# EAGLE schematic PVScontroller_v1_2_with_logo-multiple (EAGLE 7.2.0)
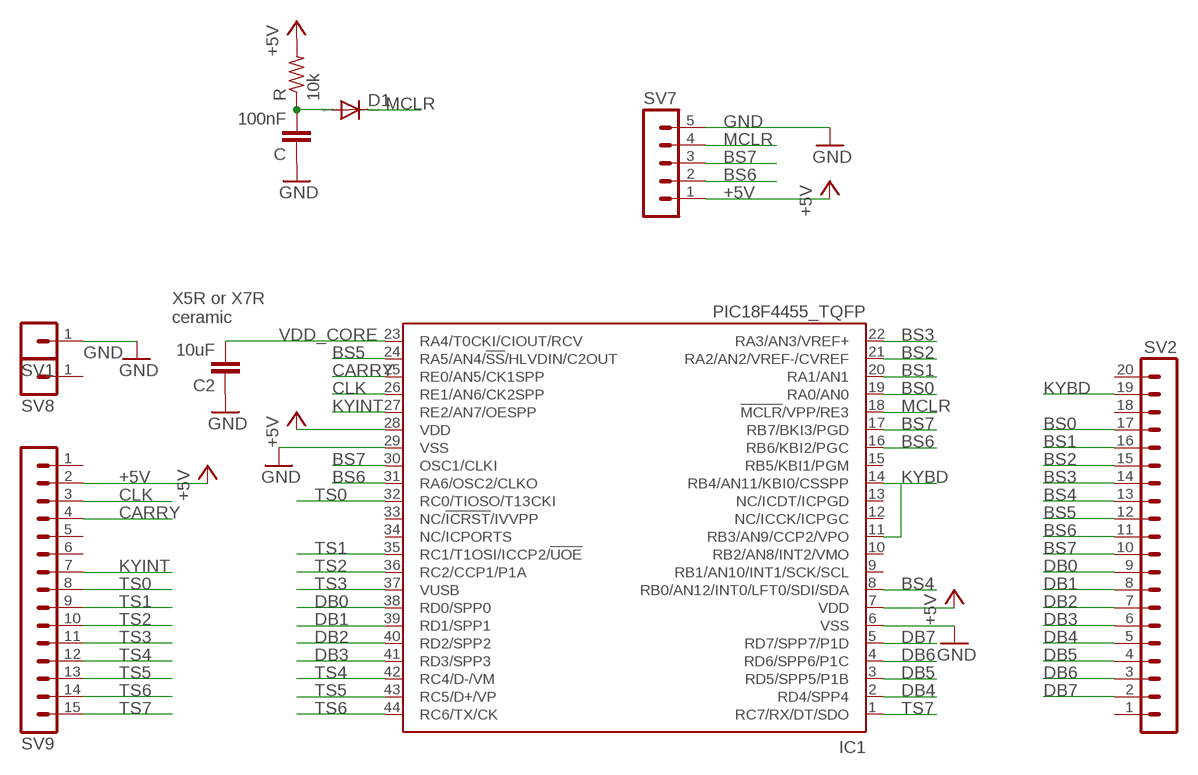
[diagram p0: schematic, sheet 1]

## Parts
C  100nF  C-EUC0805  [C0805]
C2  10uF  C-EUC0805  [C0805]
D1  DIODE-SOD80C  [SOD80C]
IC1  PIC18F4455_TQFP  [TQFP44]
R  10k  R-US_R0805  [R0805]
SV1  MA01-1  [MA01-1]
SV2  MA20-1  [MA20-1]
SV7  MA05-1  [MA05-1]
SV8  MA01-1  [MA01-1]
SV9  MA15-1  [MA15-1]

## Nets
+5V: IC1.7(VDD) IC1.28(VDD) R.2 SV7.1 SV9.2
BS0: IC1.19(RA0/AN0) SV2.17
BS1: IC1.20(RA1/AN1) SV2.16
BS2: IC1.21(RA2/AN2/VREF-/CVREF) SV2.15
BS3: IC1.22(RA3/AN3/VREF+) SV2.14
BS4: IC1.8(RB0/AN12/INT0/LFT0/SDI/SDA) SV2.13
BS5: IC1.24(RA5/AN4/!SS!/HLVDIN/C2OUT) SV2.12
BS6: IC1.16(RB6/KBI2/PGC) IC1.31(RA6/OSC2/CLKO) SV2.11 SV7.2
BS7: IC1.17(RB7/BKI3/PGD) IC1.30(OSC1/CLKI) SV2.10 SV7.3
CARRY: IC1.25(RE0/AN5/CK1SPP) SV9.4
CLK: IC1.26(RE1/AN6/CK2SPP) SV9.3
DB0: IC1.38(RD0/SPP0) SV2.9
DB1: IC1.39(RD1/SPP1) SV2.8
DB2: IC1.40(RD2/SPP2) SV2.7
DB3: IC1.41(RD3/SPP3) SV2.6
DB4: IC1.2(RD4/SPP4) SV2.5
DB5: IC1.3(RD5/SPP5/P1B) SV2.4
DB6: IC1.4(RD6/SPP6/P1C) SV2.3
DB7: IC1.5(RD7/SPP7/P1D) SV2.2
GND: C2.1 C.1 IC1.6(VSS) IC1.29(VSS) SV1.1 SV7.5
KYBD: IC1.11(RB3/AN9/CCP2/VPO) IC1.14(RB4/AN11/KBI0/CSSPP) SV2.19
KYINT: IC1.27(RE2/AN7/OESPP) SV9.7
MCLR: D1.C IC1.18(!MCLR!/VPP/RE3) SV7.4
N$4: C.2 D1.A R.1
TS0: IC1.32(RC0/TIOSO/T13CKI) SV9.8
TS1: IC1.35(RC1/T1OSI/ICCP2/!UOE) SV9.9
TS2: IC1.36(RC2/CCP1/P1A) SV9.10
TS3: IC1.37(VUSB) SV9.11
TS4: IC1.42(RC4/D-/VM) SV9.12
TS5: IC1.43(RC5/D+/VP) SV9.13
TS6: IC1.44(RC6/TX/CK) SV9.14
TS7: IC1.1(RC7/RX/DT/SDO) SV9.15
VDD_CORE: C2.2 IC1.23(RA4/T0CKI/CIOUT/RCV)
Unconnected: IC1.9(RB1/AN10/INT1/SCK/SCL) IC1.10(RB2/AN8/INT2/VMO) IC1.12(NC/ICCK/ICPGC) IC1.13(NC/ICDT/ICPGD) IC1.15(RB5/KBI1/PGM) IC1.33(NC/!ICRST!/IVVPP) IC1.34(NC/ICPORTS) SV2.1 SV2.18 SV2.20 SV8.1 SV9.1 SV9.5 SV9.6

## Notes on the sheet
- X5R or X7R
  ceramic

## Library data of the parts
C C2 = resistor:C-EU: CAPACITOR, European symbol
D1 = diode:DIODE-: DIODE
IC1 = microchip:PIC18F4*_TQFP: USB Microcontrollers with nanoWatt Technology High-Performance, Enhanced Flash, 28/40/44-Pin, Source: http://ww1.microchip.com/downloads/en/devicedoc/39632c.pdf; MF: MICROCHIP; MPN: PIC18F4455-I/PT; OC_FARNELL: 9321322; OC_NEWARK: 08J9628
R = resistor:R-US_: RESISTOR, American symbol
SV1 SV8 = joakim:MA01-1: PIN HEADER
SV2 = joakim:MA20-1: PIN HEADER; OC_FARNELL: unknown; OC_NEWARK: unknown
SV7 = joakim:MA05-1: PIN HEADER; OC_FARNELL: unknown; OC_NEWARK: unknown
SV9 = joakim:MA15-1: PIN HEADER; OC_FARNELL: unknown; OC_NEWARK: unknown